# EAGLE design interstage_A1v2 (EAGLE 9.2.2)
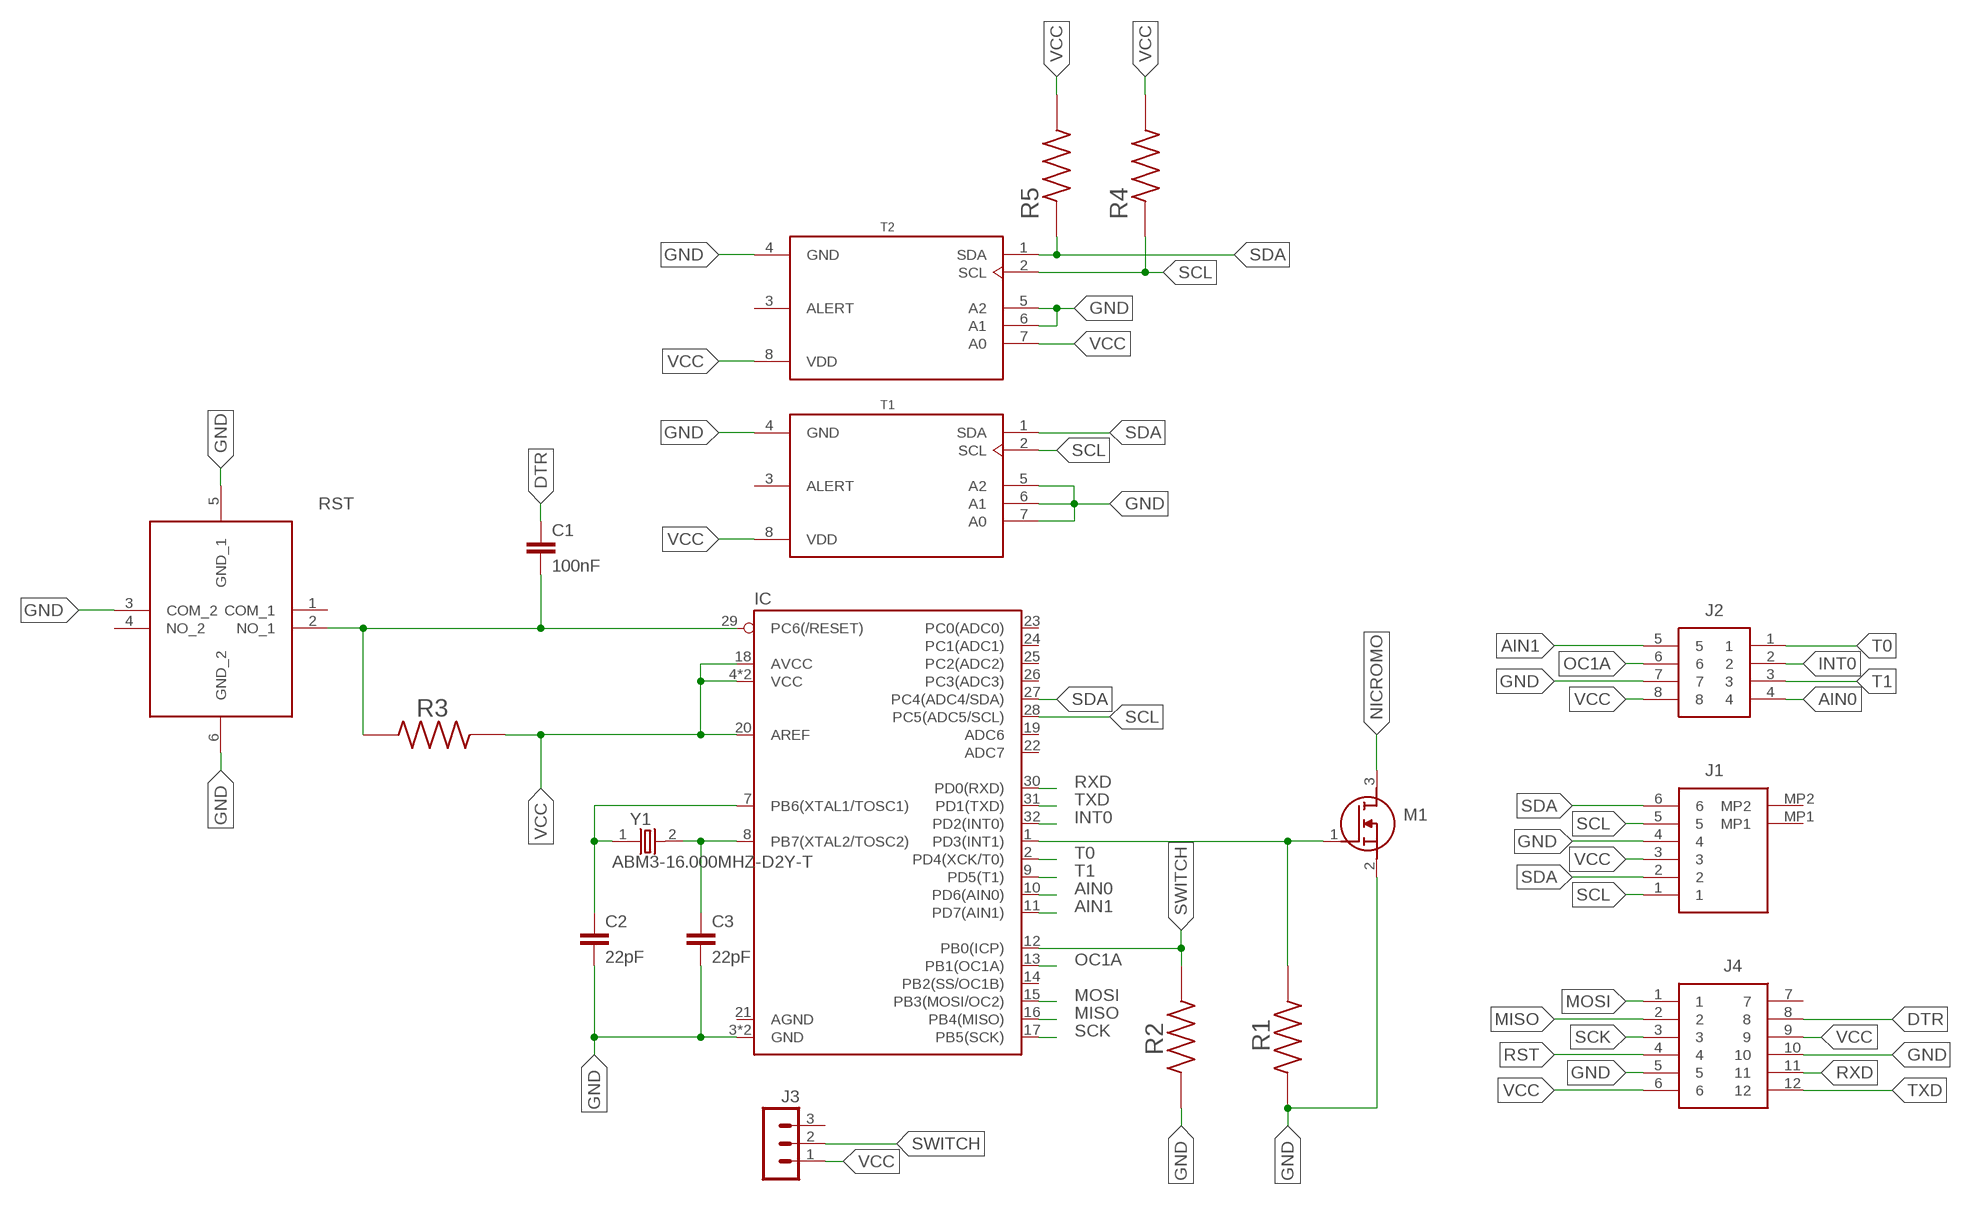
[diagram p0: schematic, sheet 1]

## Parts
C1  100nF  C-EUC0805K  [C0805K]
C2  22pF  C-EUC0603K  [C0603K]
C3  22pF  C-EUC0603K  [C0603K]
IC  ATMEGA328P_TQFP  [TQFP32-08]
J1  53261-7006  [532617006]
J2  53261-0871  [53261-0871]
J3  MA03-1  [MA03-1]
J4  53261-1271  [53261-1271]
M1  PMV16XNR  [SOT95P230X110-3N]
R1  330  ERA-8AEB331V  [RESC3216X70N]
R2  330  ERA-8AEB331V  [RESC3216X70N]
R3  10k  ERA-8AEB103V  [RESC3216X70N]
R4  4.7k  ERA-8AEB472V  [RESC3216X70N]
R5  4.7k  ERA-8AEB472V  [RESC3216X70N]
RST  431151015826  [431151015826]
T1  MCP9808T-E/MS  [SOP65P490X110-8N]
T2  MCP9808T-E/MS  [SOP65P490X110-8N]
Y1  ABM3-16.000MHZ-D2Y-T  [XTAL500X320X130N]

## Nets
AIN0: IC.10(PD6(AIN0)) J2.4
AIN1: IC.11(PD7(AIN1)) J2.5
DTR: C1.1 J4.8
GND: C2.2 C3.2 IC.3(GND) IC.5(GND) J1.4 J2.7 J4.5 J4.10 M1.2(S) R1.2 R2.1 RST.3(COM_2) RST.5(GND_1) RST.6(GND_2) T1.4(GND) T1.5(A2) T1.6(A1) T1.7(A0) T2.4(GND) T2.5(A2) T2.6(A1)
INT0: IC.32(PD2(INT0)) J2.2
INT1: IC.1(PD3(INT1)) M1.1(G) R1.1
MISO: IC.16(PB4(MISO)) J4.2
MOSI: IC.15(PB3(MOSI/OC2)) J4.1
N$1: C2.1 IC.7(PB6(XTAL1/TOSC1)) Y1.1
N$2: C3.1 IC.8(PB7(XTAL2/TOSC2)) Y1.2
NICROMO: M1.3(D)
OC1A: IC.13(PB1(OC1A)) J2.6
RST: C1.2 IC.29(PC6(/RESET)) J4.4 R3.1 RST.2(NO_1)
RXD: IC.30(PD0(RXD)) J4.11
SCK: IC.17(PB5(SCK)) J4.3
SCL: IC.28(PC5(ADC5/SCL)) J1.1 J1.5 R4.1 T1.2(SCL) T2.2(SCL)
SDA: IC.27(PC4(ADC4/SDA)) J1.2 J1.6 R5.1 T1.1(SDA) T2.1(SDA)
SWITCH: IC.12(PB0(ICP)) J3.2 R2.2
T0: IC.2(PD4(XCK/T0)) J2.1
T1: IC.9(PD5(T1)) J2.3
TXD: IC.31(PD1(TXD)) J4.12
VCC: IC.4(VCC) IC.6(VCC) IC.18(AVCC) IC.20(AREF) J1.3 J2.8 J3.1 J4.6 J4.9 R3.2 R4.2 R5.2 T1.8(VDD) T2.7(A0) T2.8(VDD)
Unconnected: IC.14(PB2(SS/OC1B)) IC.19(ADC6) IC.21(AGND) IC.22(ADC7) IC.23(PC0(ADC0)) IC.24(PC1(ADC1)) IC.25(PC2(ADC2)) IC.26(PC3(ADC3)) J1.MP1 J1.MP2 J3.3 J4.7 RST.1(COM_1) RST.4(NO_2) T1.3(ALERT) T2.3(ALERT)

## Library data of the parts
C1-C3 = rcl:C-EU: CAPACITOR, European symbol; SPICEPREFIX: C
IC = SparkFun-IC-Microcontroller:ATMEGA328P_TQFP: Popular 328P in QFP Storefront component: ATmega328 - TQFP <https://www.sparkfun.com/products/13448> (COM-13448) Datasheet <http://www.sparkfun.com/datasheets/Components/SMD/ATMega328.pdf> SparkFun Products SparkFun RedBoard - Programmed with Arduino <https://www.sparkfun.com/products/12757> (DEV-12757) Arduino Pro Mini 328 - 5V/16MHz <https://www.sparkfun.com/products/11113> (DEV-11113) Arduino Pro Mini 328 - 3.3V/8MHz <https://www.sparkfun.com/products/11114> (DEV-11114) SparkFun OpenLog <https://www.sparkfun.com/products/13712> (DEV-13712) SparkFun MicroView - OLED Arduino Module <https://www.sparkfun.com/products/12923> (DEV-12923) SparkFun Digital Sandbox <https://www.sparkfun.com/products/12651> (DEV-12651) SparkFun PicoBoard <https://www.sparkfun.com/products/11888> (WIG-11888) Arduino Fio <https://www.sparkfun.com/products/10116> (DEV-10116) LilyPad Arduino 328 Main Board <https://www.sparkfun.com/products/13342> (DEV-13342) SparkFun RedStick <https://www.sparkfun.com/products/13741> (DEV-13741) LilyPad MP3 <https://www.sparkfun.com/products/11013> (DEV-11013) LilyPad Arduino SimpleSnap <https://www.sparkfun.com/products/10941> (DEV-10941) SparkFun Stepoko <https://www.sparkfun.com/products/13899> (ROB-13899) SparkFun Geiger Counter <https://www.sparkfun.com/products/11345> (SEN-11345) SparkFun EL Sequencer <https://www.sparkfun.com/products/12781> (COM-12781) Arduino Pro 328 - 5V/16MHz <https://www.sparkfun.com/products/10915> (DEV-10915) CryptoCape <https://www.sparkfun.com/products/12773> (DEV-12773) SparkFun IR Thermometer Evaluation Board - MLX90614 <https://www.sparkfun.com/products/10740> (SEN-10740) SparkFun RedBot Mainboard <https://www.sparkfun.com/products/12097> (ROB-12097) Arduino Pro 328 - 3.3V/8MHz <https://www.sparkfun.com/products/10914> (DEV-10914) SparkFun Block for Intel® Edison - Arduino <https://www.sparkfun.com/products/13036> (DEV-13036) SparkFun Simon Says - Surface Mount Soldering Kit <https://www.sparkfun.com/products/10935> (KIT-10935) SparkFun 7-Segment Serial Display - Red <https://www.sparkfun.com/products/11441> (COM-11441) SparkFun 7-Segment Serial Display - White <https://www.sparkfun.com/products/11629> (COM-11629) SparkFun 7-Segment Serial Display - Yellow <https://www.sparkfun.com/products/11443> (COM-11443) SparkFun 7-Segment Serial Display - Kelly Green <https://www.sparkfun.com/products/11440> (COM-11440) SparkFun 7-Segment Serial Display - Blue <https://www.sparkfun.com/products/11442> (COM-11442) SparkFun OpenSegment Serial Display - 20mm (Blue) <https://www.sparkfun.com/products/11647> (COM-11647) SparkFun OpenSegment Serial Display - 20mm (Green) <https://www.sparkfun.com/products/11646> (COM-11646) SparkFun OpenSegment Serial Display - 20mm (White) <https://www.sparkfun.com/products/11648> (COM-11648) SparkFun OpenSegment Serial Display - 20mm (Red) <https://www.sparkfun.com/products/11644> (COM-11644) SparkFun OpenSegment Serial Display - 20mm (Yellow) <https://www.sparkfun.com/products/11645> (COM-11645) SparkFun OpenSegment Shield <https://www.sparkfun.com/products/13190> (DEV-13190); PROD_ID: IC-09069
J1 = SamacSys_Parts:53261-7006: 1.25mm Pitch, PicoBlade PCB Header, Single Row, Right-Angle, Surface Mount, Gold (Au) Plating, Friction Lock, Circuits, Tape and Reel Source: Datasheet <https://componentsearchengine.com/Datasheets/1/53261-7006.pdf>; DESCRIPTION: 1.25mm Pitch, PicoBlade PCB Header, Single Row, Right-Angle, Surface Mount, Gold (Au) Plating, Friction Lock, Circuits, Tape and Reel; HEIGHT: 3.6mm; MANUFACTURER_NAME: Molex; MANUFACTURER_PART_NUMBER: 53261-7006; MOUSER_PART_NUMBER: 538-53261-7006; MOUSER_PRICE-STOCK: https://www.mouser.co.uk/ProductDetail/Molex/53261-7006?qs=0lSvoLzn4L%2FSBef0BTU2GA%3D%3D
J2 = SamacSys_Parts:53261-0871: Molex PICOBLADE Series, Series Number 53261, 1.25mm Pitch, 8 Way 1 Row Shrouded Right Angle PCB Header, Surface Mount Source: Datasheet <http://www.molex.com/webdocs/datasheets/pdf/en-us/0532610871_PCB_HEADERS.pdf>; DESCRIPTION: Molex PICOBLADE Series, Series Number 53261, 1.25mm Pitch, 8 Way 1 Row Shrouded Right Angle PCB Header, Surface Mount; HEIGHT: mm; MANUFACTURER_NAME: Molex; MANUFACTURER_PART_NUMBER: 53261-0871; MOUSER_PART_NUMBER: 538-53261-0871; MOUSER_PRICE-STOCK: https://www.mouser.co.uk/ProductDetail/Molex/53261-0871?qs=%252B72YyncTwW%252BggfdCJ7Netw%3D%3D
J3 = con-lstb:MA03-1: PIN HEADER; OC_FARNELL: unknown; OC_NEWARK: unknown
J4 = SamacSys_Parts:53261-1271: Molex PICOBLADE Series, Series Number 53261, 1.25mm Pitch 12 Way 1 Row Right Angle PCB Header, Solder Termination, 1A Source: Datasheet <http://www.molex.com/webdocs/datasheets/pdf/en-us//0532611271_PCB_HEADERS.pdf>; DESCRIPTION: Molex PICOBLADE Series, Series Number 53261, 1.25mm Pitch 12 Way 1 Row Right Angle PCB Header, Solder Termination, 1A; HEIGHT: mm; MANUFACTURER_NAME: Molex; MANUFACTURER_PART_NUMBER: 53261-1271; MOUSER_PART_NUMBER: 538-53261-1271; MOUSER_PRICE-STOCK: https://www.mouser.co.uk/ProductDetail/Molex/53261-1271?qs=%252B72YyncTwW8ciqCjtXK7Ww%3D%3D
M1 = SamacSys_Parts:PMV16XNR: Nexperia PMV16XNR N-channel MOSFET, 8.6 A, 20 V PMV16XN, 3-Pin SOT-23 Source: Datasheet <https://componentsearchengine.com/Datasheets/1/PMV16XNR.pdf>; DESCRIPTION: Nexperia PMV16XNR N-channel MOSFET, 8.6 A, 20 V PMV16XN, 3-Pin SOT-23; HEIGHT: 1.1mm; MANUFACTURER_NAME: Nexperia; MANUFACTURER_PART_NUMBER: PMV16XNR; MOUSER_PART_NUMBER: 771-PMV16XNR; MOUSER_PRICE-STOCK: https://www.mouser.com/Search/Refine.aspx?Keyword=771-PMV16XNR
R1 R2 = resistor_330_smd:ERA-8AEB331V; DESCRIPTION: 330 Ohms ±0.1% 0.25W, 1/4W Chip Resistor 1206 (3216 Metric) Automotive AEC-Q200 Thin Film; DIGI-KEY_PART_NUMBER: P330BCCT-ND; MF: Panasonic Electronic; MP: ERA-8AEB331V; PACKAGE: 3216 Panasonic Electronic Components
R3 = resistor_10000_smd:ERA-8AEB103V; DESCRIPTION: 10 kOhms ±0.1% 0.25W, 1/4W Chip Resistor 1206 (3216 Metric) Automotive AEC-Q200 Thin Film; DIGI-KEY_PART_NUMBER: P10KBCCT-ND; DIGIKEY-PURCHASE-URL: https://snapeda.com/shop?store=DigiKey&id=3229630; MF: Panasonic Electronic Components; MP: ERA-8AEB103V; PACKAGE: 3216 Panasonic Electronic Components
R4 R5 = resistor_4700_smd:ERA-8AEB472V; DESCRIPTION: RES SMD 4.7K OHM 0.1% 1/4W 1206; DIGI-KEY_PART_NUMBER: P4.7KBCCT-ND; DIGIKEY-PURCHASE-URL: https://snapeda.com/shop?store=DigiKey&id=3718815; MF: Panasonic; MP: ERA-8AEB472V; PACKAGE: 3216 Panasonic Electronic Components
RST = SamacSys_Parts:431151015826: White Tactile Tactile Switch, NO 20 mA 0.3mm Surface Mount Source: Datasheet <https://componentsearchengine.com/Datasheets/2/431151015826.pdf>; DESCRIPTION: White Tactile Tactile Switch, NO 20 mA 0.3mm Surface Mount; HEIGHT: 1.6mm; MANUFACTURER_NAME: Wurth Elektronik; MANUFACTURER_PART_NUMBER: 431151015826; MOUSER_PART_NUMBER: 710-431151015826; MOUSER_PRICE-STOCK: https://www.mouser.co.uk/ProductDetail/Wurth-Elektronik/431151015826?qs=wr8lucFkNMWt0fEnpc%252BesA%3D%3D
T1 T2 = sensorSPEL:MCP9808T-E/MS: Board Mount Temperature Sensors Silicon temp sensor with I2C interface; DESCRIPTION: Temperature Sensor Digital, Local -40°C ~ 125°C 10 b 8-MSOP; DIGI-KEY_PART_NUMBER: MCP9808T-E/MSCT-ND; MF: Microchip; MP: MCP9808T-E/MS; PACKAGE: MSOP-8 Microchip
Y1 = ABM3-16.000MHZ-D2Y-T:ABM3-16.000MHZ-D2Y-T: Crystals 12MHz 18pF 30ppm -40C +85C; DESCRIPTION: 16MHz ±20ppm Crystal 18pF 40 Ohms 2-SMD, No Lead; DIGI-KEY_PART_NUMBER: 535-10638-1-ND; DIGIKEY-PURCHASE-URL: https://snapeda.com/shop?store=DigiKey&id=55267; MF: Abracon; MP: ABM3-16.000MHZ-D2Y-T; PACKAGE: SMD-2 Abracon

## Board
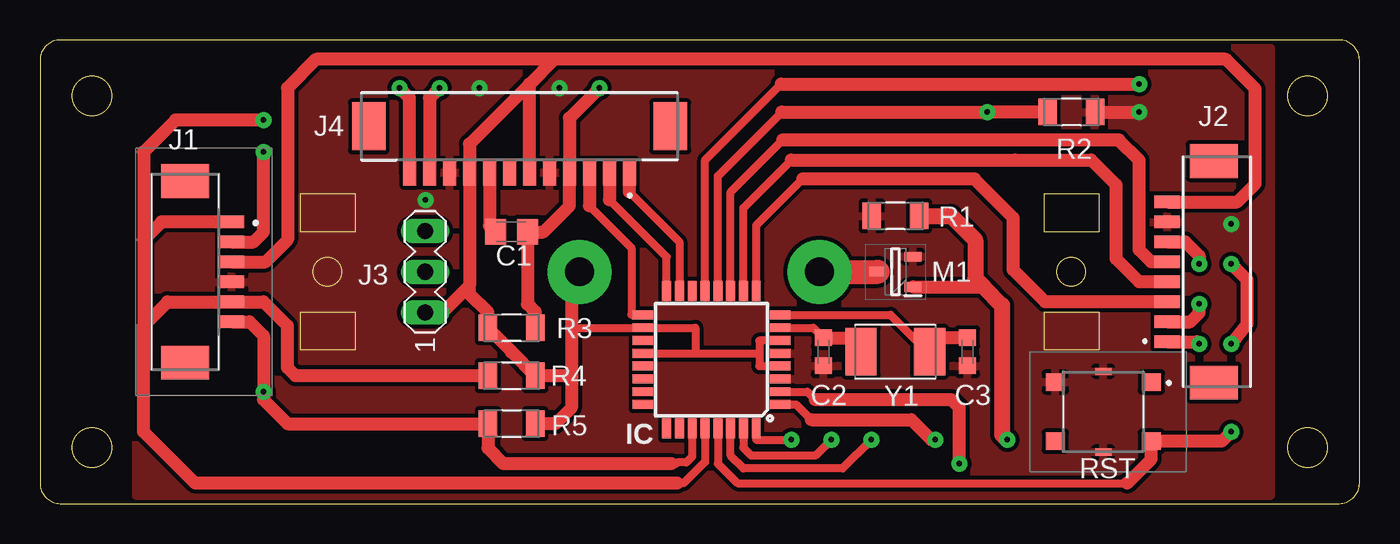
[diagram p1: board, top side]
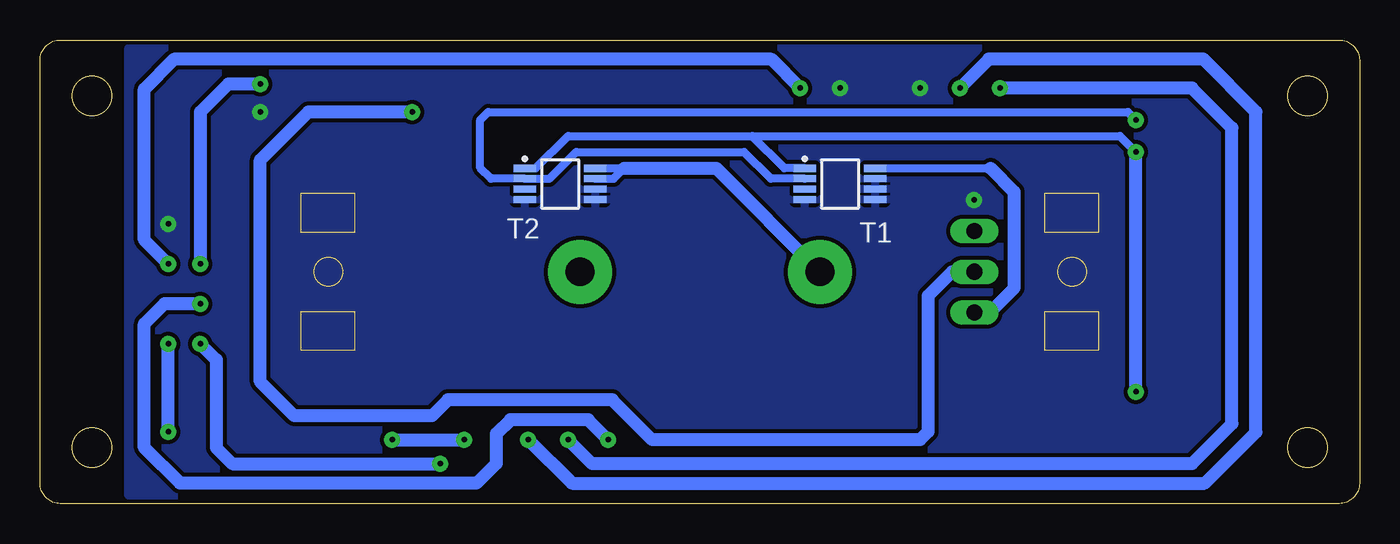
[diagram p2: board, bottom side, seen from below]

Size 82.5 x 29 mm. Coordinates in mm from the lower left corner, seen from the top.
Outline: 16.3,17 16.3,19.4 19.7,19.4 19.7,17 16.3,17
Outline: 62.8,9.6 62.8,12 66.2,12 66.2,9.6 62.8,9.6
Outline: 16.3,9.6 16.3,12 19.7,12 19.7,9.6 16.3,9.6
Outline: 62.8,17 62.8,19.4 66.2,19.4 66.2,17 62.8,17
Outline: 0,1.27 arc90 1.27,0 81.23,0 arc90 82.5,1.27 82.5,27.73 arc90 81.23,29 1.27,29 arc90 0,27.73 0,1.27
Outline: circle at 3.25,25.5 radius 1.25
Outline: circle at 79.25,3.5 radius 1.25
Outline: circle at 79.25,25.5 radius 1.25
Outline: circle at 3.25,3.5 radius 1.25
Outline: circle at 17.98,14.5 radius 0.9
Outline: circle at 64.48,14.5 radius 0.9
Copper layers (1*16): Top 0.035mm / dielectric 1.5mm / Bottom 0.035mm
Design rules "default *": minimum track width 6mil, minimum drill 0.35mm, track to track 0.2mm, track to pad 6mil, pad to pad 6mil, via to via 6mil, smd to smd 6mil, copper to edge 0mil, drill to drill 0mil, minimum pad ring 10mil, minimum via ring 8mil, stop-mask expansion 4mil, vias tented up to drill 0mil, thermal gap 10mil

### Footprints (pad centres in the part's own frame; a part is rotated, then mirrored left to right if it is on the bottom)
C0805K = smd 1.3 x 1.6: 1 -1,0; 2 1,0
C0603K = smd 1.05 x 1.08: 1 -0.875,0; 2 0.875,0
TQFP32-08 = smd 1.27 x 0.559: 1 -4.293,2.8; 2 -4.293,2; 3 -4.293,1.2; 4 -4.293,0.4; 5 -4.293,-0.4; 6 -4.293,-1.2; 7 -4.293,-2; 8 -4.293,-2.8; 17 4.293,-2.8; 18 4.293,-2; 19 4.293,-1.2; 20 4.293,-0.4; 21 4.293,0.4; 22 4.293,1.2; 23 4.293,2; 24 4.293,2.8 | smd 0.559 x 1.27: 9 -2.8,-4.293; 10 -2,-4.293; 11 -1.2,-4.293; 12 -0.4,-4.293; 13 0.4,-4.293; 14 1.2,-4.293; 15 2,-4.293; 16 2.8,-4.293; 25 2.8,4.293; 26 2,4.293; 27 1.2,4.293; 28 0.4,4.293; 29 -0.4,4.293; 30 -1.2,4.293; 31 -2,4.293; 32 -2.8,4.293
532617006 = smd 0.8 x 1.6: 1 3.125,-2.5; 2 1.875,-2.5; 3 0.625,-2.5; 4 -0.625,-2.5; 5 -1.875,-2.5; 6 -3.125,-2.5 | smd 2.1 x 3: MP1 5.675,0.4; MP2 -5.675,0.4
53261-0871 = smd 0.8 x 1.6: 1 -4.375,1.004; 2 -3.125,1.004; 3 -1.875,1.004; 4 -0.625,1.004; 5 0.625,1.004; 6 1.875,1.004; 7 3.125,1.004; 8 4.375,1.004 | smd 2.1 x 3: 9 6.925,-1.896; 10 -6.925,-1.896
MA03-1 = drill 1.016 long: 1 -2.54,0; 2 0,0; 3 2.54,0
53261-1271 = smd 0.8 x 1.6: 1 -6.875,0.8; 2 -5.625,0.8; 3 -4.375,0.8; 4 -3.125,0.8; 5 -1.875,0.8; 6 -0.625,0.8; 7 0.625,0.8; 8 1.875,0.8; 9 3.125,0.8; 10 4.375,0.8; 11 5.625,0.8; 12 6.875,0.8 | smd 2.1 x 3: 13 -9.425,-2.1; 14 9.425,-2.1
SOT95P230X110-3N = smd 1.05 x 0.6: 1 -1.1,0.95; 2 -1.1,-0.95; 3 1.1,0
RESC3216X70N = smd 1.16 x 1.68: 1 -1.475,0; 2 1.475,0
431151015826 = smd 1.2 x 1.1: 1 -3,-1.85; 2 -3,1.85; 3 3,-1.85; 4 3,1.85 | smd 1 x 0.45: 5 0,-2.525; 6 0,2.525
SOP65P490X110-8N = smd 1.4 x 0.45: 1 -2.2,0.975; 2 -2.2,0.325; 3 -2.2,-0.325; 4 -2.2,-0.975; 5 2.2,-0.975; 6 2.2,-0.325; 7 2.2,0.325; 8 2.2,0.975
XTAL500X320X130N = smd 1.95 x 2.95: 1 -2.15,0; 2 2.15,0

### Placement (x,y rotation side)
C1  29.48,17 0 top
C2  48.98,9.5 270 top
C3  57.98,9.5 270 top
IC  41.98,9 180 top
J1  9.48,14.5 90 top
J2  71.48,14.5 90 top
J3  24.08,14.5 90 top
J4  29.98,21.5 180 top
M1  53.48,14.5 180 top
R1  53.48,18 180 top
R2  64.48,24.5 180 top
R3  29.48,11 180 top
R4  29.48,8 0 top
R5  29.48,5 0 top
RST  66.48,5.75 180 top
T1  32.48,20 0 bottom
T2  49.98,20 0 bottom
Y1  53.48,9.5 0 top

### Tracks (layer width: path | path; a pad name or v marks a point on that pad's centre or on a via)
AIN0
  Top 0.5: IC.10 43.98,18.5 46.98,21.5
  Top 0.8: J2.4 68.73,13.88 67.28,15.32 67.28,19.95 65.73,21.5 60.98,21.5 46.98,21.5
AIN1
  Top 0.5: IC.11 43.18,19.5 46.43,22.75
  Top 0.8: J2.5 69.48,15.12 68.73,15.88 68.73,21.48 67.46,22.75 46.43,22.75
DTR
  Top 0.8: J4.8 28.11,17.38 C1.1
GND  (via drill 0.35 pad 1)
  Top 0.8: R2.1 v68.73,24.5
  other vias: 27.48,26 32.48,26 24.11,19 74.48,17.5
  pour Top (isolate 0.25): 5.98,28.5 5.98,0.5 76.98,0.5 76.98,28.5
  pour Bottom (isolate 0.25): 76.98,0.5 76.98,28.5 5.98,28.5 5.98,0.5
INT0  (via drill 0.35 pad 1)
  Top 0.5: IC.32 44.78,4 v46.98,4
  Top 0.8: J2.2 71.92,11.38 72.48,11.94 v72.48,12.5
  Bottom 0.8: v72.48,12.5 74.73,12.5 75.98,11.25 75.98,3.5 73.75,1.27 55.21,1.27 53.98,2.5 53.98,4.36 53.09,5.25 48.23,5.25 v46.98,4
INT1  (via drill 0.35 pad 1)
  Top 0.5: IC.1 47.28,6.2 48.23,5.25
  Top 0.8: 48.23,5.25 54.48,5.25 55.73,4 v55.98,4 | M1.1 59.01,13.55 59.02,13.54
  Top 1: v60.48,4 60.15,4.33 60.15,12.4 59.02,13.54 58.48,14.08 58.48,16.5 56.98,18 R1.1
  Bottom 0.8: v60.48,4 v55.98,4
MISO
  Top 0.5: IC.16 39.18,15.43 35.6,19
  Top 0.8: J4.2 35.6,19
MOSI
  Top 0.5: 36.85,19.5 39.98,16.38 IC.15
  Top 0.8: 36.85,19.5 J4.1
N$1
  Top 0.5: IC.7 48.35,11 C2.1 | 50.45,10.38 Y1.1
  Top 0.8: C2.1 50.45,10.38
N$2
  Top 0.5: 56.5,10.38 Y1.2 55.48,9.5 53.18,11.8 IC.8
  Top 0.8: C3.1 56.5,10.38
NICROMO  (via drill 1.8 pad 4)
  Top 1.5: v48.73,14.5 M1.3
OC1A  (via drill 0.35 pad 1)
  Top 0.5: IC.13 41.58,21.5 46.33,26.25
  Top 0.8: 46.33,26.25 v68.73,26.25 | J2.6 71.61,16.38 72.48,15.5 v72.48,15
  Bottom 0.8: v68.73,26.25 70.73,26.25 72.48,24.5 v72.48,15
RST  (via drill 0.35 pad 1)
  Top 0.5: 33.1,20 J4.4 | IC.29 42.38,2.5 43.61,1.27 67.98,1.27
  Top 0.8: R3.1 30.96,12 30.48,12.47 C1.2 31.48,17 33.1,18.62 33.1,20 | v74.48,15 75.48,14 75.48,11.25 v74.48,10 | v34.98,26 33.1,24.12 J4.4 | 67.98,1.27 69.48,2.77 RST.2 73.88,3.9 v74.48,4.5
  Bottom 0.8: v34.98,26 36.76,27.78 74.13,27.78 75.98,25.93 75.98,16.5 v74.48,15 | v74.48,4.5 v74.48,10
RXD  (via drill 0.35 pad 1)
  Top 0.5: IC.30 43.18,3 43.98,2.2 50.18,2.2 v51.98,4
  Top 0.8: v24.98,26 24.36,25.38 J4.11
  Bottom 0.8: v24.98,26 23.18,27.8 9.78,27.8 6.48,24.5 6.48,4.47 9.68,1.27 49.25,1.27 v51.98,4
SCK
  Top 0.5: 34.35,18.62 36.98,16 36.98,11.8 IC.17
  Top 0.8: J4.3 34.35,18.62
SCL  (via drill 0.35 pad 1)
  Top 0.5: 39.85,1.27 40.25,1.27 41.58,2.6 IC.28
  Top 0.8: 39.85,1.27 9.71,1.27 6.48,4.5 6.48,11.12 | 6.48,11.12 7.98,12.62 J1.5 13.98,12.62 15.48,11.12 15.48,8.5 15.98,8 R4.1 | J1.1 7.61,17.62 6.48,16.5 | 6.48,16.5 6.48,11.12 | v13.98,24 8.48,24 6.48,22 6.48,16.5
  Bottom 0.5: v13.98,24 14.48,24.5 54.48,24.5 54.98,24 54.98,21 54.3,20.32 T2.2 50.65,20.32 48.98,22 38.48,22 36.8,20.32 T1.2
SDA  (via drill 0.35 pad 1)
  Top 0.5: 39.48,2.5 39.78,2.5 39.85,2.57 40.41,2.57 40.78,2.93 IC.27
  Top 0.8: 39.48,2.5 28.98,2.5 28,3.48 R5.1 15.48,5 13.98,6.5 v13.98,7 13.98,10.5 13.11,11.38 J1.6 | J1.2 13.36,16.38 13.98,17 v13.98,22
  Bottom 0.5: 37.98,23 49.48,23 51.5,20.98 T2.1 | 37.98,23 14.98,23 v13.98,22 | T1.1 35.95,20.98 37.98,23
  Bottom 0.8: v13.98,7 v13.98,22
SWITCH  (via drill 0.35 pad 1)
  Top 0.5: IC.12 42.38,20.5 46.38,24.5
  Top 0.8: R2.2 v59.23,24.5 46.38,24.5
  Bottom 0.8: J3.2 25.48,14.5 26.98,13 26.98,4.5 27.48,4 44.23,4 46.73,6.5 56.99,6.5 57.99,5.5 66.61,5.5 68.73,7.62 68.73,21.5 65.73,24.5 v59.23,24.5
T0  (via drill 0.35 pad 1)
  Top 0.5: IC.2 47.98,7 48.48,6.5
  Top 0.8: 48.48,6.5 56.98,6.5 57.48,6 v57.48,2.5 | J2.1 72.36,10.12 v72.48,10
  Bottom 0.8: v72.48,10 71.48,9 71.48,3.5 70.48,2.5 v57.48,2.5
T1
  Top 0.5: IC.9 44.78,17.4 47.68,20.3
  Top 0.8: 47.68,20.3 58.43,20.3 60.85,17.88 60.85,14.62 62.85,12.62 J2.3
TXD  (via drill 0.35 pad 1)
  Top 0.5: IC.31 43.98,3.5 44.48,3 48.48,3 v49.48,4
  Top 0.8: v22.48,26 23.11,25.38 J4.12
  Bottom 0.8: v22.48,26 10.48,26 7.98,23.5 7.98,5 10.48,2.5 47.98,2.5 v49.48,4
VCC  (via drill 1.8 pad 4)
  Top 0.5: IC.4 44.98,8.6 44.98,9.4 | IC.6 44.98,10.2 44.98,9.4 | IC.20 40.98,9.4 | 40.98,9.4 44.98,9.4 | 40.98,9.4 40.98,11 IC.18 33.23,11 | 26.86,21.5 J4.9
  Top 0.8: v33.73,14.5 33.23,14 33.23,11 33.23,8 | J4.9 26.86,13.65 | 33.23,8 33.23,6 32.23,5 R5.2 | 26.86,21.5 26.86,22.5 30.61,26.25 | J4.6 30.61,26.25 | 32.14,27.78 74.15,27.78 75.98,25.95 75.98,20 74.86,18.88 J2.8 | 33.23,8 R4.2 29.48,9.47 29.48,9.53 R3.2 28,11.97 26.86,13.12 26.86,13.65 | J1.3 14.11,15.12 15.48,16.5 15.48,26 17.26,27.78 32.14,27.78 | 30.61,26.25 32.14,27.78 | J3.1 25.16,11.96 26.86,13.65
  Bottom 0.5: T2.8 45.98,20.98 46.63,20.32 T2.7 | T1.8 23.05,20.98
  Bottom 0.8: J3.1 23.12,11.96 21.58,13.5 21.58,19.5 23.05,20.98 | 45.98,20.98 40.2,20.98 v33.73,14.5